# Altium project Dehyrator_TV01.PrjPcb
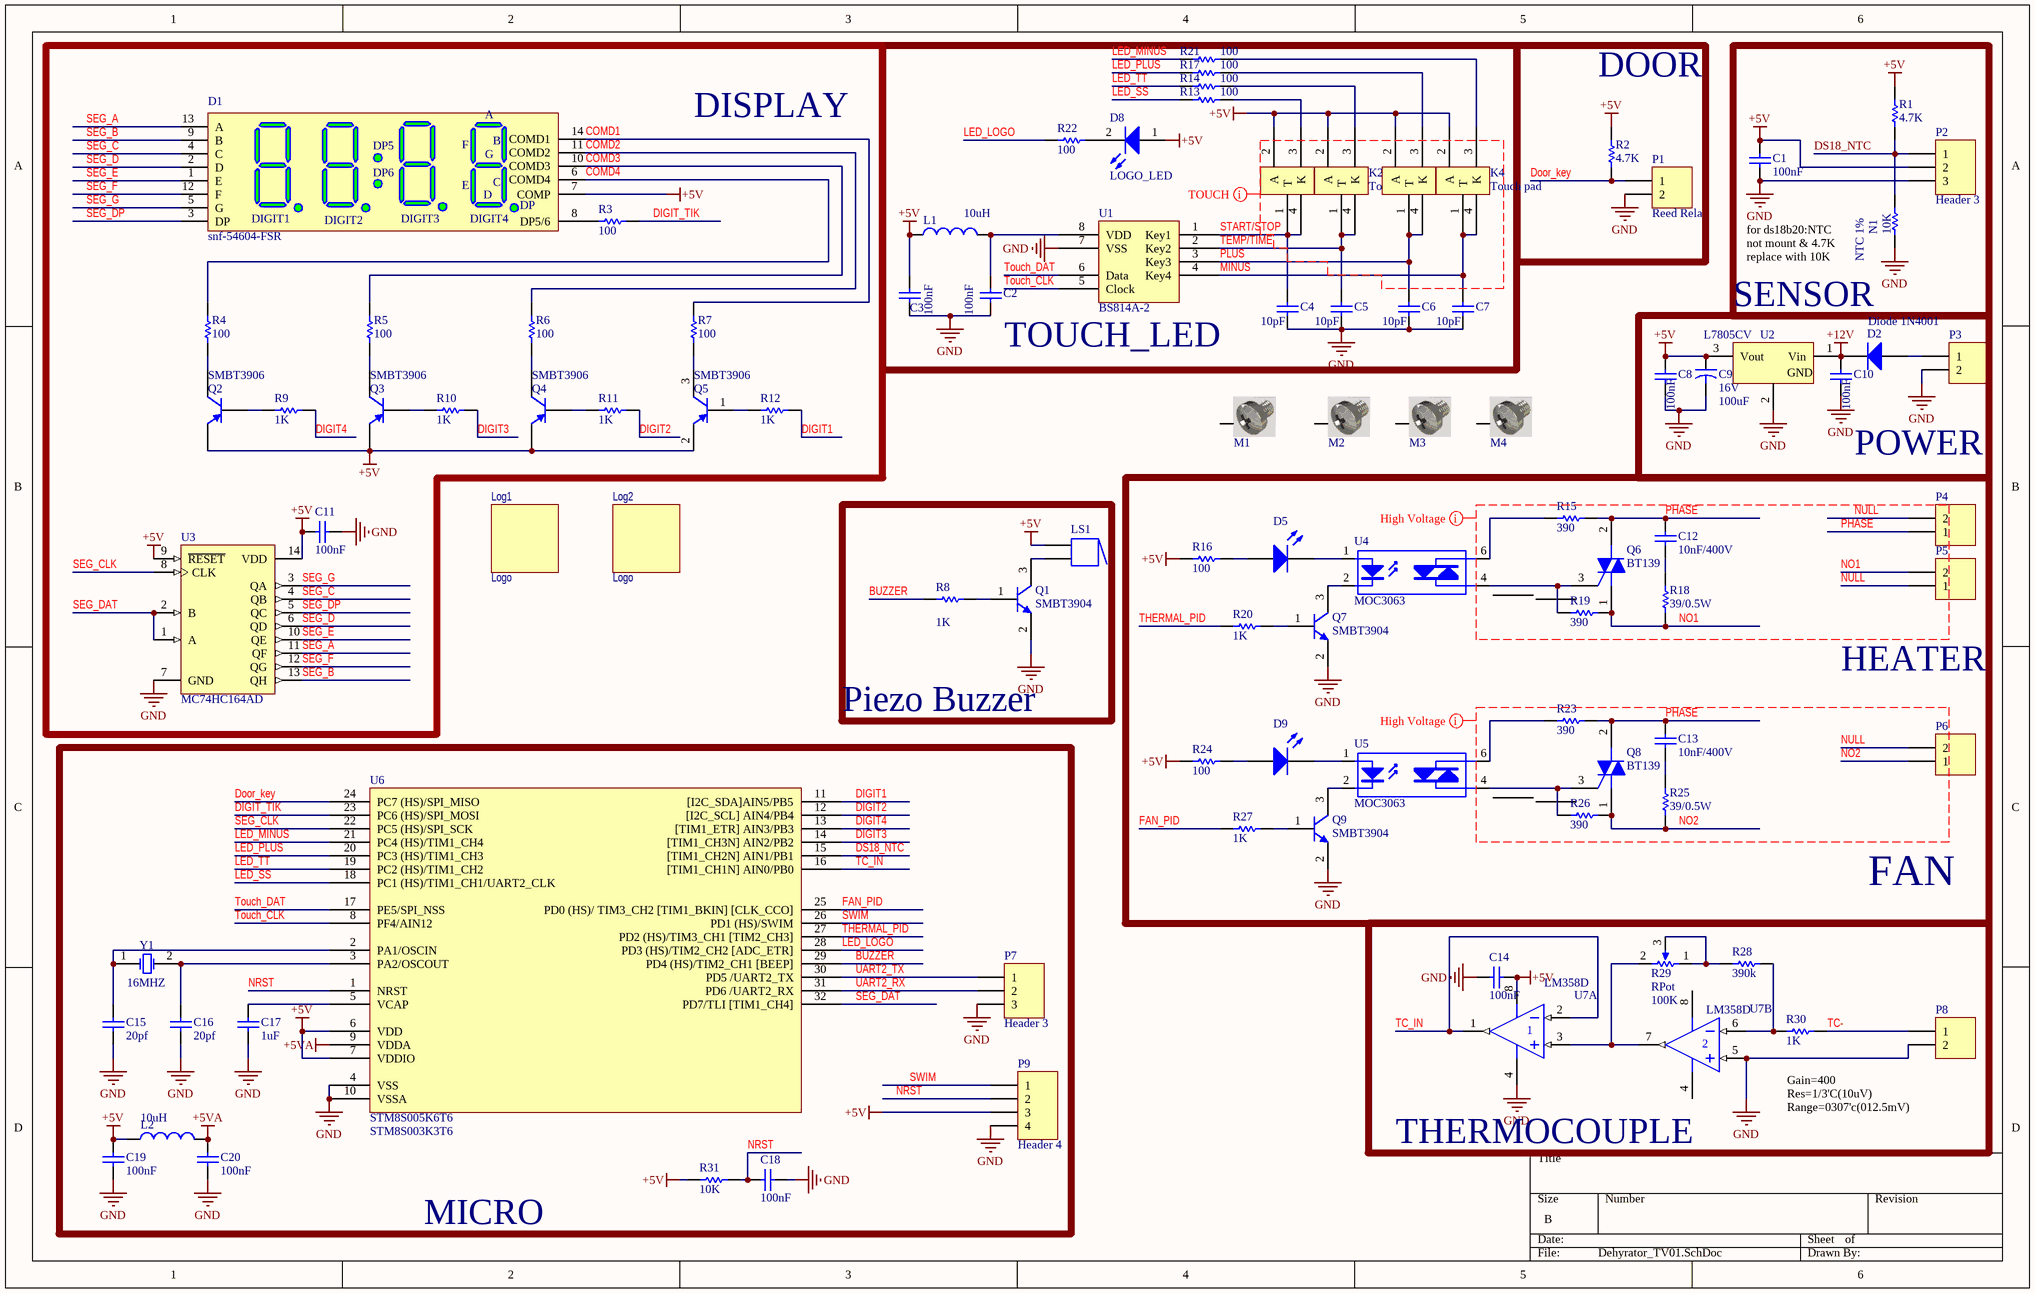
[diagram p0: Dehyrator_TV01.SchDoc]
1 sheet, 96 parts. Net scope: global (net labels, ports and power ports of the same name join across sheets).
Board files: Panel.PcbDoc, Dehyrator_TV01.PcbDoc

## Sheet Dehyrator_TV01.SchDoc
size B

### Parts
C1  value 100nF  [CAP0805]  (hidden comment: Cap)
C2  value 100nF  [CAP0805]  (hidden comment: Cap)
C3  value 100nF  [CAP0805]  (hidden comment: Cap)
C4  value 10pF  [CAP0805]  (hidden comment: Cap)
C5  value 10pF  [CAP0805]  (hidden comment: Cap)
C6  value 10pF  [CAP0805]  (hidden comment: Cap)
C7  value 10pF  [CAP0805]  (hidden comment: Cap)
C8  value 100nF  [CAP0805]  (hidden comment: Cap)
C9  16V  value 100uF  [Cap electrolitic radial 5x11-2]
C10  value 100nF  [CAP0805]  (hidden comment: Cap)
C11  value 100nF  [CAP0805]  (hidden comment: Cap)
C12  10nF/400V  [Cap_polyester_400V]
C13  10nF/400V  [Cap_polyester_400V]
C14  value 100nF  [CAP0805]  (hidden comment: Cap)
C15  value 20pf  [CAP0805]  (hidden comment: Cap)
C16  value 20pf  [CAP0805]  (hidden comment: Cap)
C17  value 1uF  [CAP0805]  (hidden comment: Cap)
C18  value 100nF  [CAP0805]  (hidden comment: Cap)
C19  value 100nF  [CAP0805]  (hidden comment: Cap)
C20  value 100nF  [CAP0805]  (hidden comment: Cap)
D1  snf-54604-FSR  [7SEG-4CLOCK-50x19]
D2  Diode 1N4001  [DO-241AC]
D5  LED1  [LED_0805]  (value not drawn)
D8  LOGO_LED  [LED5MM_BLUE]
D9  LED1  [LED_0805]  (value not drawn)
K1  Touch pad  [Touchled_Circular]
K2  Touch pad  [Touchled_Circular]
K3  Touch pad  [Touchled_Circular]
K4  Touch pad  [Touchled_Circular]
L1  value 10uH  [IND0805]  (hidden comment: Inductor)
L2  value 10uH  [IND0805]  (hidden comment: Inductor)
Log1  Logo  [LOGO_PARS_TOP]
Log2  Logo  [LOGO_PARS_TOP]
LS1  Buzzer  [BUZZER_12A05]  (value not drawn)
M1  Screw3mm  [Board Screw 3mm]  (value not drawn)
M2  Screw3mm  [Board Screw 3mm]  (value not drawn)
M3  Screw3mm  [Board Screw 3mm]  (value not drawn)
M4  Screw3mm  [Board Screw 3mm]  (value not drawn)
N1  NTC 1%  value 10K  [Axial 0_25 W, 0_4 IN LEAD PITCH]
P1  Reed Relay  [DS1070-2-COMCON]
P2  Header 3  [XH-3PIN]
P3  Header 2  [KF301 2PIN]  (value not drawn)
P4  Header 2  [KF301 2PIN]  (value not drawn)
P5  Header 2  [KF301 2PIN]  (value not drawn)
P6  Header 2  [KF301 2PIN]  (value not drawn)
P7  Header 3  [PIN_M_1x3]
P8  Header 2  [KF35C 2PIN]  (value not drawn)
P9  Header 4  [HDR_1x4]
Q1  SMBT3904  [SOT23_N]
Q2  SMBT3906  [SOT23_N]
Q3  SMBT3906  [SOT23_N]
Q4  SMBT3906  [SOT23_N]
Q5  SMBT3906  [SOT23_N]
Q6  BT139  [TO-220 AB WITH HEAT SINK]
Q7  SMBT3904  [SOT23_N]
Q8  BT139  [TO-220 AB WITH HEAT SINK]
Q9  SMBT3904  [SOT23_N]
R1  value 4.7K  [RES0805]  (hidden comment: Res1)
R2  value 4.7K  [RES0805]  (hidden comment: Res1)
R3  value 100  [RES0805]  (hidden comment: Res1)
R4  value 100  [RES0805]  (hidden comment: Res1)
R5  value 100  [RES0805]  (hidden comment: Res1)
R6  value 100  [RES0805]  (hidden comment: Res1)
R7  value 100  [RES0805]  (hidden comment: Res1)
R8  value 1K  [RES0805]  (hidden comment: Res1)
R9  value 1K  [RES0805]  (hidden comment: Res1)
R10  value 1K  [RES0805]  (hidden comment: Res1)
R11  value 1K  [RES0805]  (hidden comment: Res1)
R12  value 1K  [RES0805]  (hidden comment: Res1)
R13  value 100  [RES0805]  (hidden comment: Res1)
R14  value 100  [RES0805]  (hidden comment: Res1)
R15  value 390  [Axial 0_5W 5_0mm]  (hidden comment: Res1)
R16  value 100  [RES0805]  (hidden comment: Res1)
R17  value 100  [RES0805]  (hidden comment: Res1)
R18  value 39/0.5W  [Axial 1W  7_0mm]  (hidden comment: Res1)
R19  value 390  [Axial 0_5W 5_0mm]  (hidden comment: Res1)
R20  value 1K  [RES0805]  (hidden comment: Res1)
R21  value 100  [RES0805]  (hidden comment: Res1)
R22  value 100  [RES0805]  (hidden comment: Res1)
R23  value 390  [Axial 0_5W 5_0mm]  (hidden comment: Res1)
R24  value 100  [RES0805]  (hidden comment: Res1)
R25  value 39/0.5W  [Axial 1W  7_0mm]  (hidden comment: Res1)
R26  value 390  [Axial 0_5W 5_0mm]  (hidden comment: Res1)
R27  value 1K  [RES0805]  (hidden comment: Res1)
R28  value 390k  [RES0805]  (hidden comment: Res1)
R29  RPot  value 100K  [Potentiometer_4mm_3364A_smd]
R30  value 1K  [RES0805]  (hidden comment: Res1)
R31  value 10K  [RES0805]  (hidden comment: Res1)
U1  BS814A-2  [SO-8N]
U2  L7805CV  [TO-220 AB WITH HEAT SINK]
U3  MC74HC164AD  [SO14_N]
U4  MOC3063  [MOC3063]
U5  MOC3063  [MOC3063]
U6  STM8S005K6T6  [LQFP32_N]
U7  LM358D  [SO-8N]  (parts A,B of 2)
Y1  16MHZ  [CRYSTAL Small]

### Blocks framed on the sheet
DISPLAY: C11 D1 Q2-Q5 R3-R7 R9-R12 U3
TOUCH_LED: C2-C7 D8 K1-K4 L1 R13 R14 R17 R21 R22 U1
DOOR: P1 R2
SENSOR: C1 N1 P2 R1
FAN: C12 C13 D5 D9 P4-P6 Q6-Q9 R15 R16 R18-R20 R23-R27 U4 U5
Piezo Buzzer: LS1 Q1 R8
MICRO: C15-C20 L2 P7 P9 R31 U6 Y1
THERMOCOUPLE: C14 P8 R28-R30 U7

### Nets
+5V: C1.2 C3.2 C8.2 C9.1 C11.2 C14.1 C19.2 D1.7(COMP) D8.1(A) K1.2(A) K2.2(A) K3.2(A) K4.2(A) L1.1 L2.1 LS1.1 P2.2 P9.3 Q2.2(E) Q3.2(E) Q4.2(E) Q5.2(E) R1.2 R2.2 R16.1 R24.1 R31.1 U2.3(Vout) U3.9(~{RESET}) U3.14(VDD) U6.6(VDD) U6.7(VDDIO) U7.8(V+)
+5VA: C20.2 L2.2 U6.9(VDDA)
+12V: C10.2 D2.2(K) U2.1(Vin)
GND: C1.1 C2.1 C3.1 C4.1 C5.1 C6.1 C7.1 C8.1 C9.2 C10.1 C11.1 C14.2 C15.1 C16.1 C17.1 C18.2 C19.1 C20.1 N1.2 P1.2 P2.3 P3.2 P7.3 P8.2 P9.4 Q1.2(E) Q7.2(E) Q9.2(E) U1.7(VSS) U2.2(GND) U3.7(GND) U6.4(VSS) U6.10(VSSA) U7.4(V-) U7.5(IN+)
BUZZER: R8.1 U6.29(PD4_(HS)/TIM2_CH1_[BEEP])
COMD1: D1.14(COMD1) R7.2
COMD2: D1.11(COMD2) R6.2
COMD3: D1.10(COMD3) R5.2
COMD4: D1.6(COMD4) R4.2
DIGIT1: R12.2 U6.11([I2C_SDA]AIN5/PB5)
DIGIT2: R11.2 U6.12([I2C_SCL]_AIN4/PB4)
DIGIT3: R10.2 U6.14([TIM1_CH3N]_AIN2/PB2)
DIGIT4: R9.2 U6.13([TIM1_ETR]_AIN3/PB3)
DIGIT_TIK: R3.2 U6.23(PC6_(HS)/SPI_MOSI)
Door_key: P1.1 R2.1 U6.24(PC7_(HS)/SPI_MISO)
DS18_NTC: N1.1 P2.1 R1.1 U6.15([TIM1_CH2N]_AIN1/PB1)
FAN_PID: R27.1 U6.25(PD0_(HS)/_TIM3_CH2_[TIM1_BKIN]_[CLK_CCO])
LED_LOGO: R22.1 U6.28(PD3_(HS)/TIM2_CH2_[ADC_ETR])
LED_MINUS: R21.1 U6.21(PC4_(HS)/TIM1_CH4)
LED_PLUS: R17.1 U6.20(PC3_(HS)/TIM1_CH3)
LED_SS: R13.1 U6.18(PC1_(HS)/TIM1_CH1/UART2_CLK)
LED_TT: R14.1 U6.19(PC2_(HS)/TIM1_CH2)
MINUS: C7.2 K4.1(T) K4.4 U1.4(Key4)
NO1: P5.2 Q6.1(M1) R18.1 R19.1
NO2: P6.1 Q8.1(M1) R25.1 R26.1
NRST: C18.1 P9.2 R31.2 U6.1(NRST)
NULL: P4.2 P5.1 P6.2
PHASE: C12.1 C13.1 P4.1 Q6.2(M2) Q8.2(M2) R15.1 R23.1
PLUS: C6.2 K3.1(T) K3.4 U1.3(Key3)
SEG_A: D1.13(A) U3.11(QF)
SEG_B: D1.9(B) U3.13(QH)
SEG_C: D1.4(C) U3.4(QB)
SEG_CLK: U3.8(CLK) U6.22(PC5_(HS)/SPI_SCK)
SEG_D: D1.2(D) U3.6(QD)
SEG_DAT: U3.1(A) U3.2(B) U6.32(PD7/TLI_[TIM1_CH4])
SEG_DP: D1.3(DP) U3.5(QC)
SEG_E: D1.1(E) U3.10(QE)
SEG_F: D1.12(F) U3.12(QG)
SEG_G: D1.5(G) U3.3(QA)
START/STOP: C4.2 K1.1(T) K1.4 U1.1(Key1)
SWIM: P9.1 U6.26(PD1_(HS)/SWIM)
TC-: P8.1 R30.2
TC_IN: U6.16([TIM1_CH1N]_AIN0/PB0) U7.1(OUT) U7.2(IN-)
TEMP/TIME: C5.2 K2.1(T) K2.4 U1.2(Key2)
THERMAL_PID: R20.1 U6.27(PD2_(HS)/TIM3_CH1_[TIM2_CH3])
Touch_CLK: U1.5(Clock) U6.8(PF4/AIN12)
Touch_DAT: U1.6(Data) U6.17(PE5/SPI_NSS)
UART2_RX: P7.2 U6.31(PD6_/UART2_RX)
UART2_TX: P7.1 U6.30(PD5_/UART2_TX)
NetC2_2: C2.2 L1.2 U1.8(VDD)
NetC12_2: C12.2 R18.2
NetC13_2: C13.2 R25.2
NetC15_2: C15.2 U6.2(PA1/OSCIN) Y1.1(OSC1)
NetC16_2: C16.2 U6.3(PA2/OSCOUT) Y1.2(OSC2)
NetC17_2: C17.2 U6.5(VCAP)
NetD1_8: D1.8(DP5/6) R3.1
NetD2_1: D2.1(A) P3.1
NetD5_1: D5.1(A) R16.2
NetD5_2: D5.2(K) U4.1(A)
NetD8_2: D8.2(K) R22.2
NetD9_1: D9.1(A) R24.2
NetD9_2: D9.2(K) U5.1(A)
NetK1_3: K1.3(K) R13.2
NetK2_3: K2.3(K) R14.2
NetK3_3: K3.3(K) R17.2
NetK4_3: K4.3(K) R21.2
NetLS1_2: LS1.2 Q1.3(C)
NetQ1_1: Q1.1(B) R8.2
NetQ2_1: Q2.1(B) R9.1
NetQ2_3: Q2.3(C) R4.1
NetQ3_1: Q3.1(B) R10.1
NetQ3_3: Q3.3(C) R5.1
NetQ4_1: Q4.1(B) R11.1
NetQ4_3: Q4.3(C) R6.1
NetQ5_1: Q5.1(B) R12.1
NetQ5_3: Q5.3(C) R7.1
NetQ6_3: Q6.3(G) R19.2 U4.4(A/K)
NetQ7_1: Q7.1(B) R20.2
NetQ7_3: Q7.3(C) U4.2(K)
NetQ8_3: Q8.3(G) R26.2 U5.4(A/K)
NetQ9_1: Q9.1(B) R27.2
NetQ9_3: Q9.3(C) U5.2(K)
NetR15_2: R15.2 U4.6(A/K)
NetR23_2: R23.2 U5.6(A/K)
NetR28_1: R28.1 R29.1(TOP) R29.3(TAP)
NetR28_2: R28.2 R30.1 U7.6(IN-)
NetR29_2: R29.2(BOT) U7.3(IN+) U7.7(OUT)

Not connected (* = marked no-connect by the designer): M1 S; M2 S; M3 S; M4 S; U4 3(NC) 5(NC); U5 3(NC) 5(NC)

### Layout directives
net class HV: NO1, NO2, NULL, PHASE
net class Touch: (no net found under the mark)

### Notes on the sheet
- for ds18b20:NTC not mount & 4.7K replace with 10K
- POWER
- HEATER
- (near U6) STM8S003K3T6
- Gain=400
  Res=1/3'C(10uV)
  Range=0307'c(012.5mV)
- (in symbol 7SEG-CLOCK-14PIN) DP5; DP6; DIGIT1; DIGIT2; DIGIT3; DIGIT4

### Library data of the parts
C1-C8 C10-C20 = Cap: Capacitor; Published: 8-Jun-2000; LatestRevisionDate: 17-Jul-2002; LatestRevisionNote: Re-released for DXP Platform.; PackageReference: RAD-0.3; Publisher: Altium Limited; PackageDescription: Radial Cap, Thru-Hole; 2 Leads; 0.3 in Pin Spacing
  C12 C13: Value: 10nF/400V
C9 = Cap2: Capacitor; Published: 23-Sep-2002; PackageReference: CAPR5-4X5; Publisher: Altium Limited; PackageDescription: Capacitor; 2 Leads
D1 = 7SEG-CLOCK-14PIN: 4-Digit LED Display CLOCK
D2 = Diode 1N4001: 1 Amp General Purpose Rectifier; Published: 8-Jun-2000; LatestRevisionDate: 17-Jul-2002; LatestRevisionNote: Re-released for DXP Platform.; DatasheetVersion: 1998; PackageVersion: Aug-1999; PackageReference: DO-41; Publisher: Altium Limited; PackageDescription: Diode, Axial; Body 5.2 x 2.7 mm (LxDia. max), Lead Dia. 0.86 mm (max); Code_JEDEC: DO-204-AL; ComponentLink1Description: Manufacturer Link; ComponentLink1URL: http://www.fairchildsemi.com/; ComponentLink2Description: Datasheet; ComponentLink2URL: http://www.fairchildsemi.com/ds/1N%2F1N4001.pdf
D5 D9 = LED1: Typical RED GaAs LED; Published: 8-Jun-2000; LatestRevisionDate: 08-Jul-2005; LatestRevisionNote: Mech Layer 1 removed.; PackageReference: LED-1; Publisher: Altium Limited; PackageDescription: LED; 2 Leads
D8 = LED0: Typical INFRARED GaAs LED; Published: 8-Jun-2000; LatestRevisionDate: 08-Jul-2005; LatestRevisionNote: Mech Layer 1 removed.; PackageReference: LED-0; Publisher: Altium Limited; PackageDescription: LED; 2 Leads
K1-K4 = Touch_Pad: Capacitive touch
L1 L2 = Inductor: Code_IEC: 1005; Published: 8-Jun-2000; LatestRevisionDate: 29-May-2009; LatestRevisionNote: IPC-7351 Footprint Added.; PackageReference: 0402-A; Publisher: Altium Limited; PackageDescription: Chip Inductor; Code_JEITA: 0402
LS1 = Buzzer: Magnetic Transducer Buzzer; Published: 24-Mar-1999; LatestRevisionDate: 17-Dec-2003; LatestRevisionNote: Schematic revised, PCB Footprint replaced.; DatasheetVersion: 17-Dec-2003; PackageReference: ABSM-1574; Publisher: Altium Limited; PackageDescription: Magnetic Transducer Buzzer; ComponentLink1Description: Manufacturer Link; ComponentLink1URL: http://www.megastar.com/linecard/buzzmode/index.php
M1-M4 = Board Screw 3mm: Board Screw With Spacer 3mm; Designer: Abbas Basereh; Data: 16-12-2016; Link: *; Part. No: *
N1 R1-R28 R30 R31 = Res1: Resistor; Published: 8-Jun-2000; LatestRevisionDate: 17-Jul-2002; LatestRevisionNote: Re-released for DXP Platform.; PackageReference: AXIAL-0.3; Publisher: Altium Limited; PackageDescription: Axial Device, Thru-Hole; 2 Leads; 0.3 in Pin Spacing
P1 P3-P6 P8 = Header 2: Header, 2-Pin; LatestRevisionDate: 17-Jul-2002; LatestRevisionNote: Re-released for DXP Platform.; Publisher: Altium Limited
P2 P7 = Header 3: Header, 3-Pin; LatestRevisionDate: 17-Jul-2002; LatestRevisionNote: Re-released for DXP Platform.; Publisher: Altium Limited
P9 = Header 4: Header, 4-Pin; LatestRevisionDate: 17-Jul-2002; LatestRevisionNote: Re-released for DXP Platform.; Publisher: Altium Limited
Q1 Q7 Q9 = SMBT3904: NPN Silicon Switching Transistor, 40 V VCEO, 200 mA IC, SOT23, Reel, Green; Manufacturer: Infineon; Green: TRUE; IC: 10 mA; IC (max): 200 mA; ICBO (max): 50 nA; VCBO (max): 60 V; VCE: 1 V; VCEO (max): 40 V; VEBO (max): 6 V; PackageVersion: Apr-08; PackageReference: SOT23; PackageDescription: 3-Pin Small Outline Transistor Package, 1.3 x 2.9 mm Body, 0.95 mm Pitch; Supplier 1: Newark; Supplier Part Number 1: 97K9949; Supplier 2: Farnell; Supplier Part Number 2: 1056539; Supplier 3: Farnell; Supplier Part Number 3: 1056539RL; Packing: Reel; Polarity: NPN; VCE (max): 1 V; Mounting Technology: Surface Mount; PartNumber: SMBT3904; ComponentLink1Description: Manufacturer URL; ComponentLink1URL: http://www.infineon.com/; ComponentLink2Description: Datasheet; ComponentLink2URL: http://www.infineon.com/dgdl/smbt3904series_mmbt3904.pdf?folderId=db3a30431441fb5d011445fab851018e&fileId=db3a30431441fb5d0114460005c10191; ComponentLink3Description: Package Specification; ComponentLink3URL: http://www.infineon.com/dgdl/SOT23-Package_Overview.pdf?folderId=db3a30431936bc4b0119532290053c66&fileId=db3a30431936bc4b0119533468123c85
Q2-Q5 = SMBT3906: PNP Silicon Switching Transistor, 40 V VCEO, 200 mA IC, SOT23, Reel, Green; Manufacturer: Infineon; Green: TRUE; IC: 10 mA; IC (max): 200 mA; ICBO (max): 50 nA; VCBO (max): 40 V; VCE: 1 V; VEBO (max): 6 V; PackageVersion: Apr-08; PackageReference: SOT23; PackageDescription: 3-Pin Small Outline Transistor Package, 1.3 x 2.9 mm Body, 0.95 mm Pitch; Supplier 1: Mouser; Supplier Part Number 1: N/A; Supplier 2: Farnell; Supplier Part Number 2: 1056540RL; Packing: Reel; Polarity: PNP; VCE (max): 1 V; VCEO (max): 40 V; Mounting Technology: Surface Mount; PartNumber: SMBT3906; ComponentLink1Description: Manufacturer URL; ComponentLink1URL: http://www.infineon.com/; ComponentLink2Description: Datasheet; ComponentLink2URL: http://www.infineon.com/dgdl/smbt3906_mmbt3906series.pdf?folderId=db3a30431441fb5d011445fab851018e&fileId=db3a30431441fb5d01144604610f0192; ComponentLink3Description: Package Specification; ComponentLink3URL: http://www.infineon.com/dgdl/SOT23-Package_Overview.pdf?folderId=db3a30431936bc4b0119532290053c66&fileId=db3a30431936bc4b0119533468123c85
Q6 Q8 = Triac: Silicon Bidirectional Triode Thyristor; Note: Pin 2 is electrically connected to Pin 4 (TAB); Published: 29-Sep-2000; LatestRevisionDate: 17-Jul-2002; LatestRevisionNote: Re-released for DXP Platform.; DatasheetVersion: 1999; PackageReference: 369-03; Publisher: Altium Limited; PackageDescription: TO, Thru-Hole, Vertical, Heatsink Mounted; 3 In-Line Leads; Pitch 2.28 mm; ComponentLink1Description: Manufacturer Link; ComponentLink1URL: http://www.motorola.com/
R29 = RPot: Potentiometer; Sim Note: Enter the Resistance value and the set point into parameter fields.; Set Position: 0.5; Published: 8-Jun-2000; LatestRevisionDate: 17-Jul-2002; LatestRevisionNote: Re-released for DXP Platform.; PackageReference: VR5; Publisher: Altium Limited; PackageDescription: Variable Resistor, Thru-Hole; 3 Leads
U1 = BS814A-2: Holtek Touch Key
U2 = L7805CV-Linear Voltage Regulator IC Positive 1 Output 5V 1.5A TO-220AB: Linear Voltage Regulator IC Positive FIXED; Manufacturer: STMicroelectronics; Designer: Abbas Basereh; Link: https://www.aliexpress.com/item/; Link: http://www.tme.eu/en/; Link: http://www.digikey.com/; Part. No: L7805CV
U3 = MC74HC164AD: 8-Bit Serial Input / Parallel-Output Shift Register; Published: 15-Apr-2002; LatestRevisionDate: 13-Apr-2006; LatestRevisionNote: IPC-7351 Footprint Added.; DatasheetVersion: Mar-2000; PackageReference: 751A-03; Publisher: Altium Limited; PackageDescription: 14-Pin Small Outline Integrated Circuit 1.27 mm Pitch; Code_JEDEC: MS-012-AB; Code_IPC: SOIC127P600-14; ComponentLink1Description: Manufacturer Link; ComponentLink1URL: http://www.onsemi.com/; ComponentLink2Description: Datasheet; ComponentLink2URL: http://www.onsemi.com/pub/Collateral/MC74HC164A-D.PDF
U4 U5 = Opto TRIAC: Opto-Triac; Published: 24-Mar-1999; LatestRevisionDate: 17-Jul-2002; LatestRevisionNote: Re-released for DXP Platform.; PackageReference: NPSIP4A; Publisher: Altium Limited; PackageDescription: SIP; 4 Leads; Body 10 x 11.5 x 7.5 mm (typ); Pitch 2.54 mm
U6 = STM8S005K6T6: Value line, 16 MHz STM8S 8-bit MCU, 32-Kbyte Flash memory,data EEPROM, 10-bit ADC, timers, UART, SPI, I²C
U7 = LM358D: Dual Low-Power Operational Amplifier; Published: 17-Jul-2002; LatestRevisionDate: 13-Apr-2006; LatestRevisionNote: IPC-7351 Footprint Added.; DatasheetVersion: 1988; PackageReference: 751-02; Publisher: Altium Limited; PackageDescription: 8-Pin Small Outline Integrated Circuit 1.27 mm Pitch; Code_JEDEC: MS-012-AA; Code_IPC: SOIC127P600-8; ComponentLink1Description: Manufacturer Link; ComponentLink1URL: http://www.onsemi.com/site/products/parametrics/0,4446,251,00.html; ComponentLink2Description: Datasheet; ComponentLink2URL: http://www.onsemi.com/pub/Collateral/LM358-D.PDF
Y1 = ECS-110-S-5P: Crystal Oscillator; Published: 17-Jul-2002; DatasheetDocument: 18-Apr-2000; PackageReference: CSM-7; Publisher: Altium Limited; ComponentLink1Description: Manufacturer Link; ComponentLink1URL: http://www.ecsxtal.com/; ComponentLink2Description: Datasheet; ComponentLink2URL: http://www.ecsxtal.com/pdf3/CSM_7.pdf